# Altium schematic sheet YiWallet-Enc-memory.SchDoc
size A4
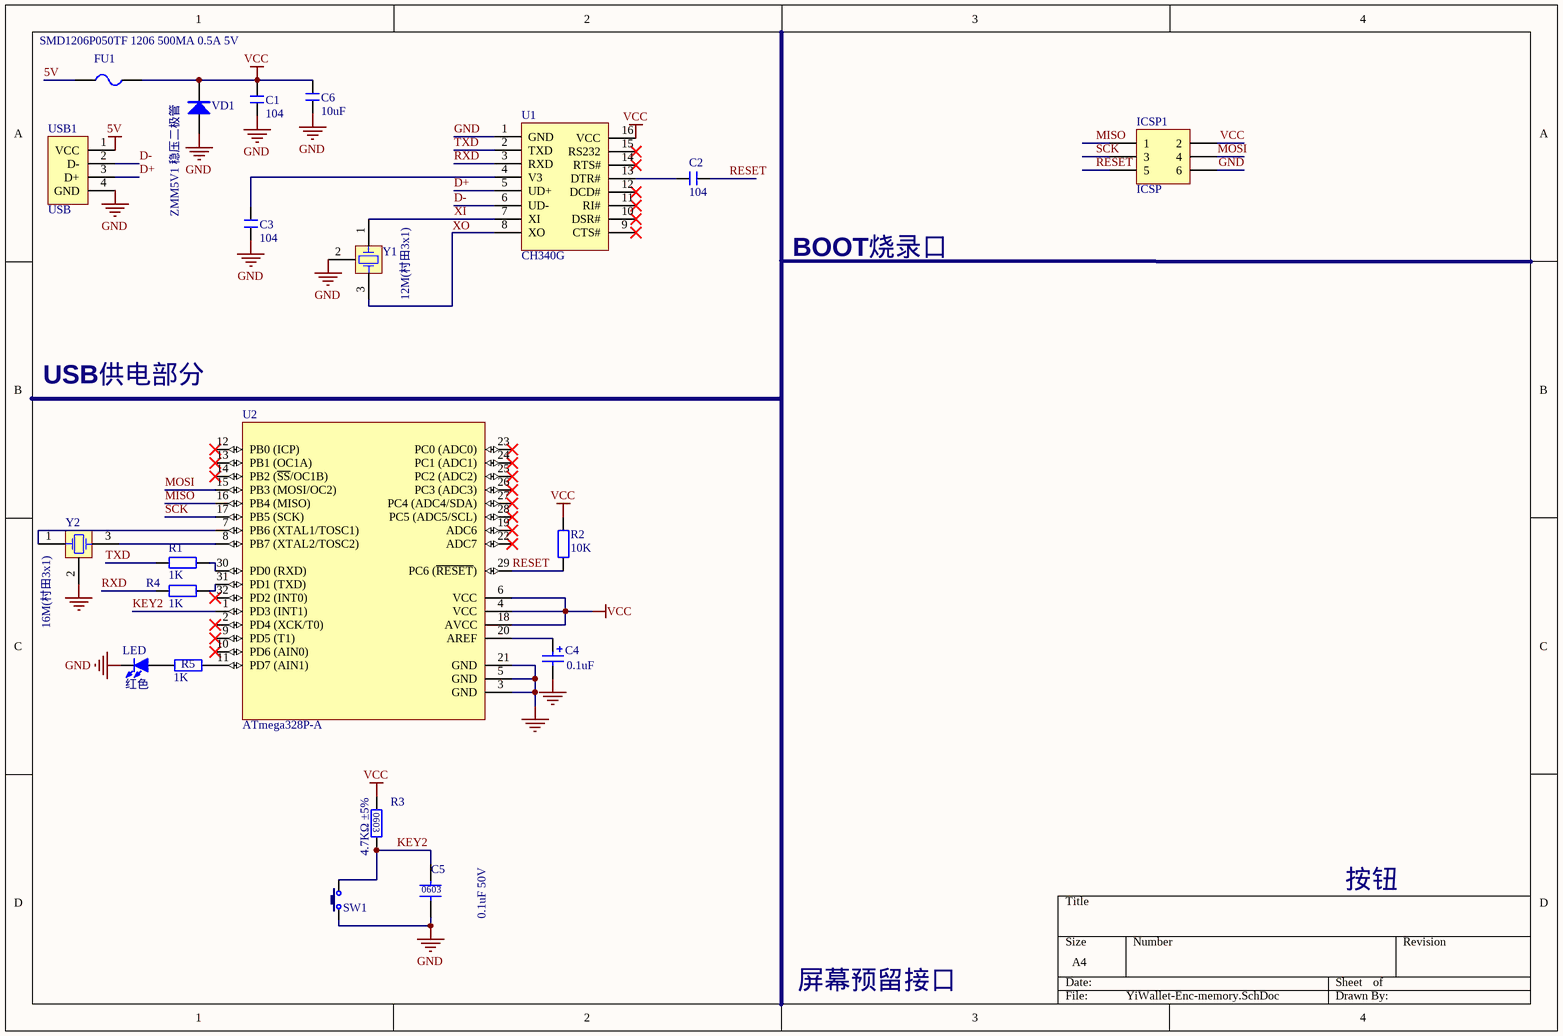
[diagram p0: YiWallet-Enc-memory.SchDoc]

## Parts
C1  104  [C 0603_L]
C2  104  [C 0603_L]
C3  104  [C 0603_L]
C4  0.1uF  [C 0603_L]
C5  0.1uF 50V  [C 0603_L]
C6  10uF  [C 0603_L]
FU1  SMD1206P050TF 1206 500MA 0.5A 5V  [FU 1206]
ICSP1  ICSP  [PH2.0-LI-6P]
LED  红色  [LED 0603G]
R1  1K  [R 0603_L]
R2  10K  [R 0603_L]
R3  4.7KΩ ±5%  [C 0603_L]
R4  1K  [R 0603_L]
R5  1K  [R 0603_L]
SW1  3x6x5  [TSW SMD-3*6*2.5]  (value not drawn)
U1  CH340G  [SO-16]
U2  ATmega328P-A  [TQFP32-7*7]
USB1  USB  [USB_A/P_A]
VD1  ZMM5V1 稳压二极管  [MINI_MELF (LL34)]
Y1  12M(村田3x1)  [X-CPX20]
Y2  16M(村田3x1)  [X-CPX20]

## Nets
5V: FU1.1 USB1.1(VCC)
GND: C1.1 C3.1 C4.2 C5.2 C6.1 ICSP1.6 LED.2(K) SW1.1 U1.1(GND) U2.3(GND) U2.5(GND) U2.21(GND) USB1.4(GND) VD1.1(A) Y1.2(COM) Y2.2(COM)
VCC: C1.2 C6.2 FU1.2 ICSP1.2 R2.2 R3.1 U1.16(VCC) U2.4(VCC) U2.6(VCC) U2.18(AVCC) VD1.2(K)
D+: U1.5(UD+) USB1.3(D+)
D-: U1.6(UD-) USB1.2(D-)
KEY2: C5.1 R3.2 SW1.2 U2.1(PD3_(INT1))
MISO: ICSP1.1 U2.16(PB4_(MISO))
MOSI: ICSP1.4 U2.15(PB3_(MOSI/OC2))
RESET: C2.2 ICSP1.5 R2.1 U2.29(PC6_(~{RESET}))
RXD: R4.2 U1.3(RXD)
SCK: ICSP1.3 U2.17(PB5_(SCK))
TXD: R1.2 U1.2(TXD)
XI: U1.7(XI) Y1.1(OSC1)
XO: U1.8(XO) Y1.3(OSC2)
NetC2_1: C2.1 U1.13(DTR#)
NetC3_2: C3.2 U1.4(V3)
NetC4_1: C4.1 U2.20(AREF)
NetLED_1: LED.1(A) R5.2
NetR1_1: R1.1 U2.30(PD0_(RXD))
NetR4_1: R4.1 U2.31(PD1_(TXD))
NetR5_1: R5.1 U2.11(PD7_(AIN1))
NetU2_7: U2.7(PB6_(XTAL1/TOSC1)) Y2.1(OSC1)
NetU2_8: U2.8(PB7_(XTAL2/TOSC2)) Y2.3(OSC2)

Not connected (* = marked no-connect by the designer): U1 9(CTS#)* 10(DSR#)* 11(RI#)* 12(DCD#)* 14(RTS#)* 15(RS232)*; U2 2(PD4_(XCK/T0))* 9(PD5_(T1))* 10(PD6_(AIN0))* 12(PB0_(ICP))* 13(PB1_(OC1A))* 14(PB2_(~{SS}/OC1B))* 19(ADC6)* 22(ADC7)* 23(PC0_(ADC0))* 24(PC1_(ADC1))* 25(PC2_(ADC2))* 26(PC3_(ADC3))* 27(PC4_(ADC4/SDA))* 28(PC5_(ADC5/SCL))* 32(PD2_(INT0))*

## Notes on the sheet
- BOOT烧录口
- USB供电部分
- 按钮
- 屏幕预留接口
- (in symbol C-0.1uF 50V 0603) 0603
- (in symbol R-4K7 0603 5%) 0603

## Library data of the parts
C1-C3 C6 = C: 无极性贴片电容; 版权归属: 源创客; BOM名称: 无极性贴片电容; 学习资源: www.ooocke.com
C4 = Cap Pol3: Polarized Capacitor (Surface Mount); Published: 8-Jun-2000; Revision: July-2002: Re-released for DXP Platform.; Publisher: Altium Limited; Value: 0.1uF
C5 = C-0.1uF 50V 0603: 贴片电容 0.1uF 50V ±10% -55~+125℃ 0603 X7R CL10B104KB8NNNC; LH: C01-100N26-100; U_TABLE: U_C
FU1 = FU: 贴片保险丝; 版权归属: 源创客; BOM名称: 贴片保险丝; 学习资源: www.ooocke.com
ICSP1 = Header 3X2: Header, 3-Pin, Dual row; LatestRevisionDate: 17-Jul-2002; LatestRevisionNote: Re-released for DXP Platform.; Publisher: Altium Limited
LED = LED-SMD: 贴片LED; 版权归属: 源创客; BOM名称: 贴片LED; 学习资源: www.ooocke.com
R1 R2 R4 R5 = R: 贴片电阻; 版权归属: 源创客; BOM名称: 贴片电阻; 学习资源: www.ooocke.com
R3 = R-4K7 0603 5%: 贴片电阻 4.7KΩ 1/10W ±5% ±200ppm 0603; LH: R01-4K7026-100; U_TABLE: U_R
SW1 = TSW 3x6: 3x6轻触开关; 版权归属: 源创客; BOM名称: 3x6轻触开关; 学习资源: www.ooocke.com
U2 = ATmega8-16AC: 8-Bit AVR Microcontroller with 8K Bytes of In-System Programmable Flash Memory
USB1 = USB-A/P: USB-A型公接口; 版权归属: 源创客; BOM名称: USB-A型公接口; 学习资源: www.ooocke.com
VD1 = 1N4148: 高速开关二极管; 版权归属: 源创客; BOM名称: 高速开关二极管; 学习资源: www.ooocke.com
Y1 Y2 = ECS-35-17-4-3IL: Crystal Oscillator, 3rd In-Line Lead Version; Published: 17-Jul-2002; Datasheet: Latest Revision: 18-Apr-2000; Package Reference: HC-49US; Publisher: Altium Limited